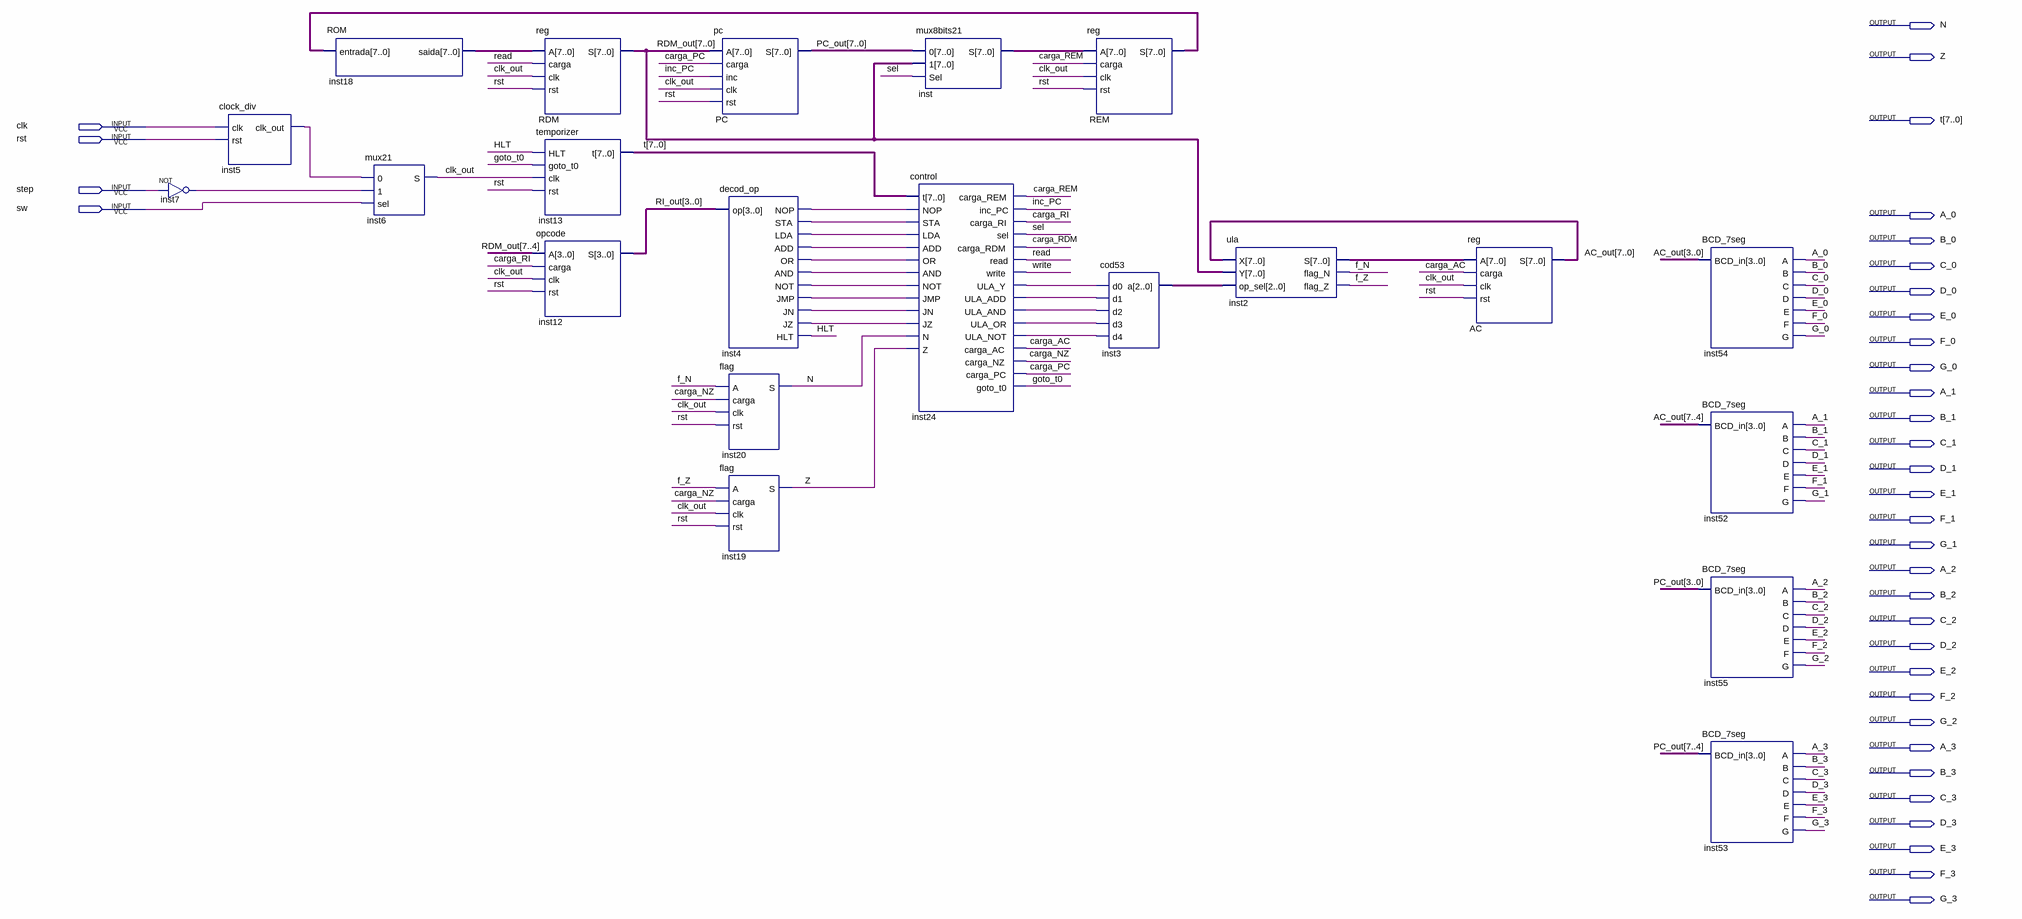
[diagram p0: schematic sheet]
// Quartus schematic neander.bdf as structural Verilog: 21 symbols, 35 pins
module neander (
  input  clk,
  input  rst,
  input  step,
  input  sw,
  output N,
  output Z,
  output [7:0] t,
  output A_0,
  output B_0,
  output C_0,
  output D_0,
  output E_0,
  output F_0,
  output G_0,
  output A_1,
  output B_1,
  output C_1,
  output D_1,
  output E_1,
  output F_1,
  output G_1,
  output A_2,
  output B_2,
  output C_2,
  output D_2,
  output E_2,
  output F_2,
  output G_2,
  output A_3,
  output B_3,
  output C_3,
  output D_3,
  output E_3,
  output F_3,
  output G_3
);

  wire carga_AC, carga_NZ, carga_PC, carga_RDM, carga_REM, carga_RI, clk_out, f_N, f_Z, goto_t0, HLT, inc_PC,
       inst4_add, inst4_and, inst4_jmp, inst4_jn, inst4_jz, inst4_lda, inst4_nop, inst4_not, inst4_or,
       inst4_sta, inst5_clk_out, inst7_out, inst24_ula_add, inst24_ula_and, inst24_ula_not, inst24_ula_or,
       inst24_ula_y, read, sel, write;
  wire [2:0] inst3_a;
  wire [3:0] RI_out;
  wire [7:0] AC_out, inst2_s, inst18_saida, inst_s, PC_out, RDM_out, REM_s;

  not inst7 (inst7_out, step);
  clock_div inst5 (.clk(clk), .rst(rst), .clk_out(inst5_clk_out));
  ROM inst18 (.entrada(REM_s), .saida(inst18_saida));
  mux21 inst6 (.\0 (inst5_clk_out), .\1 (inst7_out), .sel(sw), .S(clk_out));
  \reg  RDM (.A(inst18_saida), .carga(read), .clk(clk_out), .rst(rst), .S(RDM_out));
  temporizer inst13 (.HLT(HLT), .goto_t0(goto_t0), .clk(clk_out), .rst(rst), .t(t));
  opcode inst12 (.A(RDM_out[7:4]), .carga(carga_RI), .clk(clk_out), .rst(rst), .S(RI_out));
  pc PC (.A(RDM_out), .carga(carga_PC), .inc(inc_PC), .clk(clk_out), .rst(rst), .S(PC_out));
  decod_op inst4 (
    .op(RI_out), .NOP(inst4_nop), .STA(inst4_sta), .LDA(inst4_lda), .ADD(inst4_add), .OR(inst4_or),
    .AND(inst4_and), .NOT(inst4_not), .JMP(inst4_jmp), .JN(inst4_jn), .JZ(inst4_jz), .HLT(HLT));
  flag inst20 (.A(f_N), .carga(carga_NZ), .clk(clk_out), .rst(rst), .S(N));
  flag inst19 (.A(f_Z), .carga(carga_NZ), .clk(clk_out), .rst(rst), .S(Z));
  mux8bits21 inst (.\0 (PC_out), .\1 (RDM_out), .Sel(sel), .S(inst_s));
  control inst24 (
    .t(t), .NOP(inst4_nop), .STA(inst4_sta), .LDA(inst4_lda), .ADD(inst4_add), .OR(inst4_or),
    .AND(inst4_and), .NOT(inst4_not), .JMP(inst4_jmp), .JN(inst4_jn), .JZ(inst4_jz), .N(N), .Z(Z),
    .carga_REM(carga_REM), .inc_PC(inc_PC), .carga_RI(carga_RI), .sel(sel), .carga_RDM(carga_RDM),
    .read(read), .write(write), .ULA_Y(inst24_ula_y), .ULA_ADD(inst24_ula_add), .ULA_AND(inst24_ula_and),
    .ULA_OR(inst24_ula_or), .ULA_NOT(inst24_ula_not), .carga_AC(carga_AC), .carga_NZ(carga_NZ),
    .carga_PC(carga_PC), .goto_t0(goto_t0));
  \reg  REM (.A(inst_s), .carga(carga_REM), .clk(clk_out), .rst(rst), .S(REM_s));
  cod53 inst3 (
    .d0(inst24_ula_y), .d1(inst24_ula_add), .d2(inst24_ula_and), .d3(inst24_ula_or), .d4(inst24_ula_not),
    .a(inst3_a));
  ula inst2 (.X(AC_out), .Y(RDM_out), .op_sel(inst3_a), .S(inst2_s), .flag_N(f_N), .flag_Z(f_Z));
  \reg  AC (.A(inst2_s), .carga(carga_AC), .clk(clk_out), .rst(rst), .S(AC_out));
  BCD_7seg inst54 (.BCD_in(AC_out[3:0]), .A(A_0), .B(B_0), .C(C_0), .D(D_0), .E(E_0), .F(F_0), .G(G_0));
  BCD_7seg inst52 (.BCD_in(AC_out[7:4]), .A(A_1), .B(B_1), .C(C_1), .D(D_1), .E(E_1), .F(F_1), .G(G_1));
  BCD_7seg inst55 (.BCD_in(PC_out[3:0]), .A(A_2), .B(B_2), .C(C_2), .D(D_2), .E(E_2), .F(F_2), .G(G_2));
  BCD_7seg inst53 (.BCD_in(PC_out[7:4]), .A(A_3), .B(B_3), .C(C_3), .D(D_3), .E(E_3), .F(F_3), .G(G_3));
endmodule
